# EasyEDA Pro project 电机舵机DCDC驱动板.eprj, schematic Schematic1

## Sheets
1 P1: Board Name: Board1; Create Date: 2025-06-23; Page Name: P1; Project Name: 电机舵机DCDC驱动板; Schematic Name: Schematic1; Update Date: 2025-07-10; Company: 嘉立创EDA; Page Size: A4; Version: V1.0
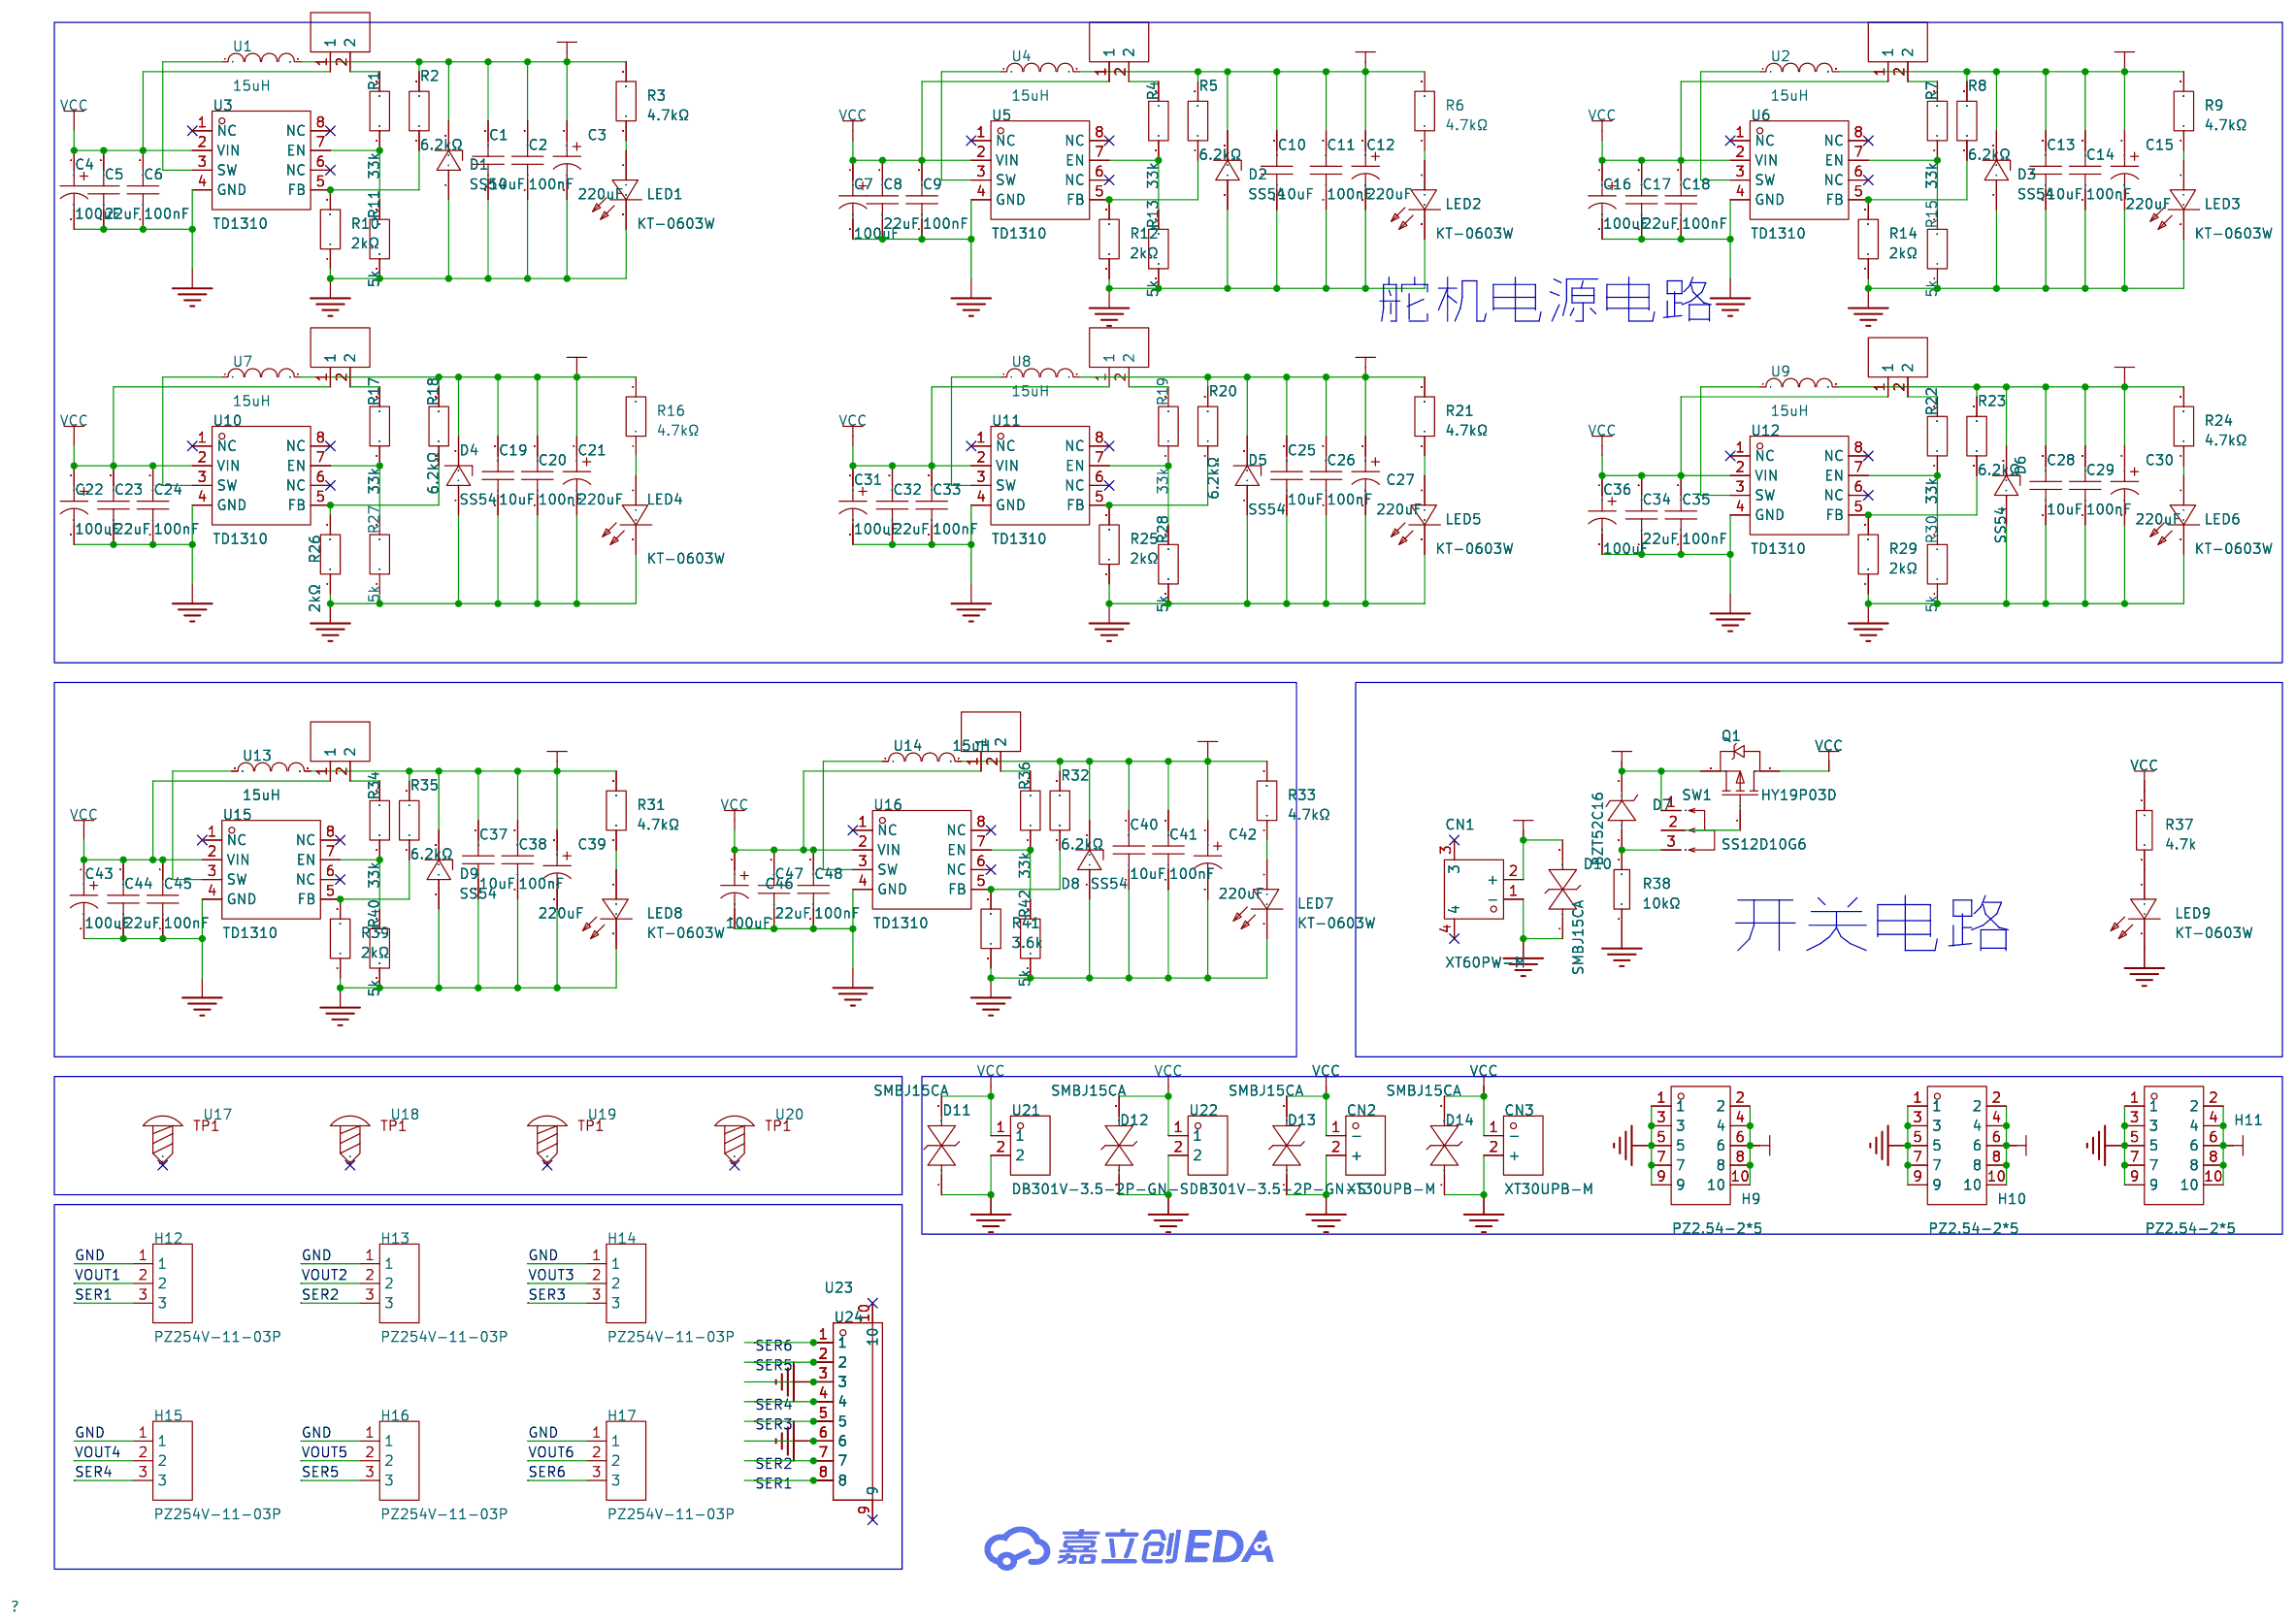
[diagram p0: P1]
2 TPS54821-BUCK: Create Date: 2025-07-09; Page Name: TPS54821-BUCK; Update Date: 2025-07-11; File: TPS54821-BUCK; Id: /; Sheet: /
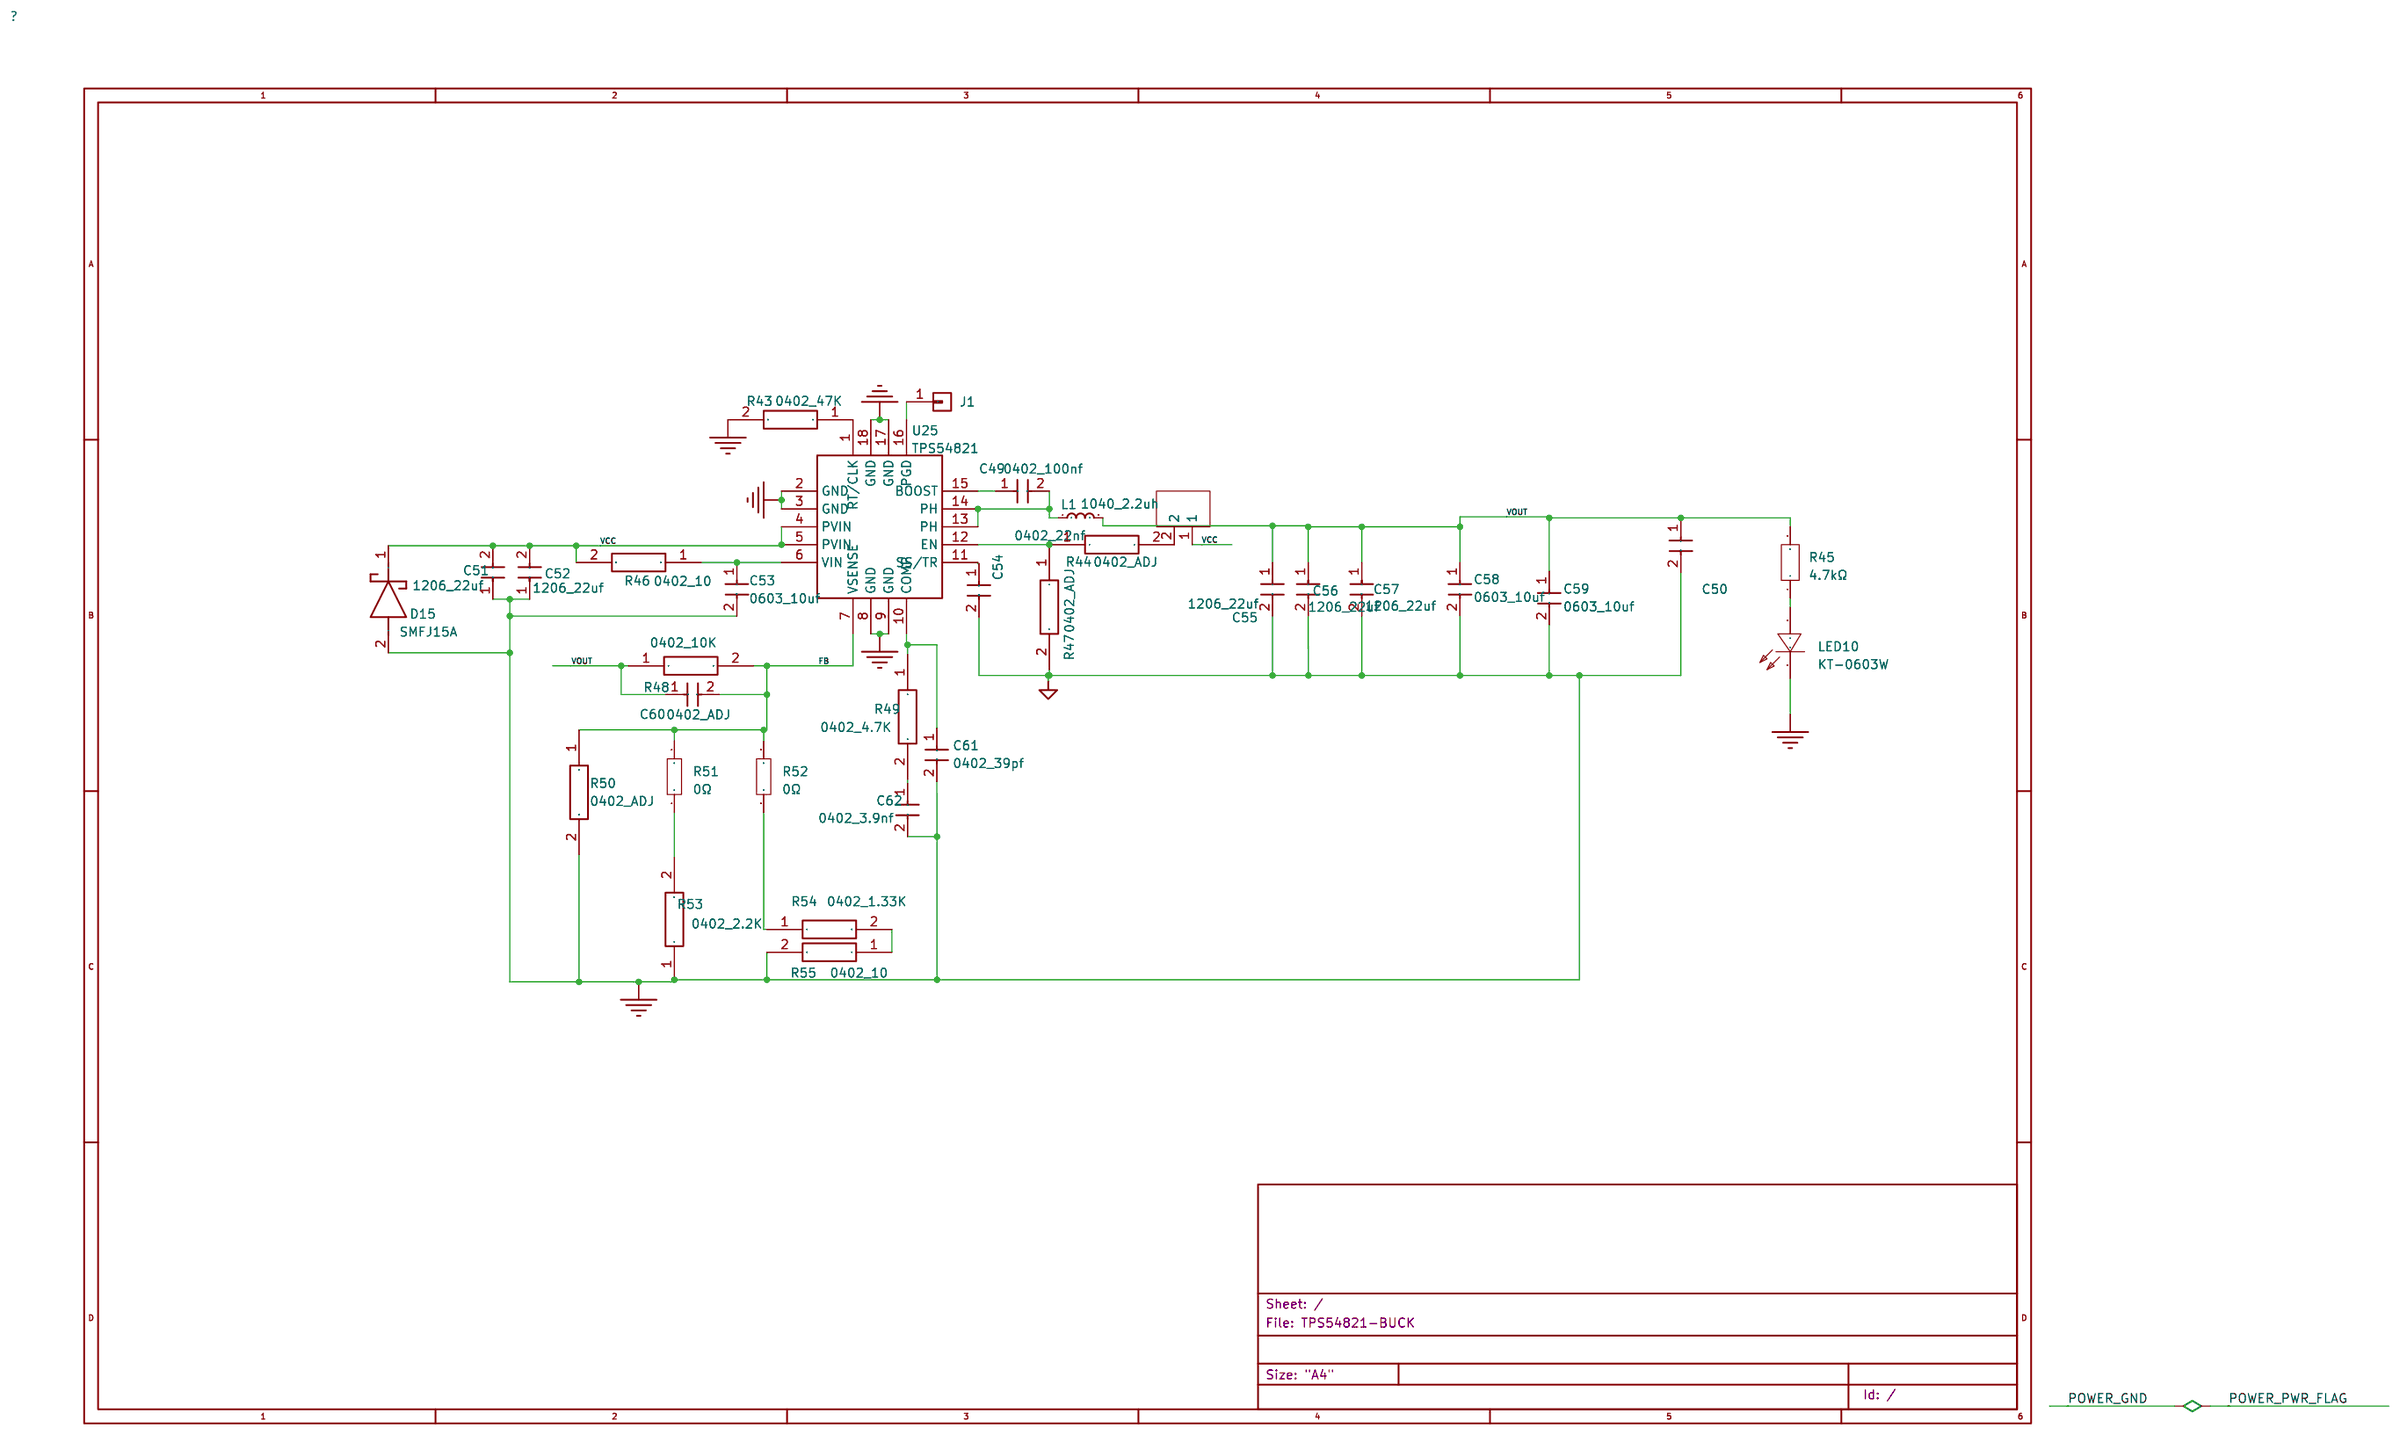
[diagram p1: TPS54821-BUCK]

## Parts
sheet P1
C1  10uF  [C0603]
C2  100nF  [C0402]
C3  220uF  [CAP-SMD_BD6.3-L6.6-W6.6-LS7.8-FD]
C4  100uF  [CAP-SMD_BD6.3-L6.5-W6.5-LS7.0-FD]
C5  22uF  [C0805]
C6  100nF  [C0402]
C7  100uF  [CAP-SMD_BD6.3-L6.5-W6.5-LS7.0-FD]
C8  22uF  [C0805]
C9  100nF  [C0402]
C10  10uF  [C0603]
C11  100nF  [C0402]
C12  220uF  [CAP-SMD_BD6.3-L6.6-W6.6-LS7.8-FD]
C13  10uF  [C0603]
C14  100nF  [C0402]
C15  220uF  [CAP-SMD_BD6.3-L6.6-W6.6-LS7.8-FD]
C16  100uF  [CAP-SMD_BD6.3-L6.5-W6.5-LS7.0-FD]
C17  22uF  [C0805]
C18  100nF  [C0402]
C19  10uF  [C0603]
C20  100nF  [C0402]
C21  220uF  [CAP-SMD_BD6.3-L6.6-W6.6-LS7.8-FD]
C22  100uF  [CAP-SMD_BD6.3-L6.5-W6.5-LS7.0-FD]
C23  22uF  [C0805]
C24  100nF  [C0402]
C25  10uF  [C0603]
C26  100nF  [C0402]
C27  220uF  [CAP-SMD_BD6.3-L6.6-W6.6-LS7.8-FD]
C28  10uF  [C0603]
C29  100nF  [C0402]
C30  220uF  [CAP-SMD_BD6.3-L6.6-W6.6-LS7.8-FD]
C31  100uF  [CAP-SMD_BD6.3-L6.5-W6.5-LS7.0-FD]
C32  22uF  [C0805]
C33  100nF  [C0402]
C34  22uF  [C0805]
C35  100nF  [C0402]
C36  100uF  [CAP-SMD_BD6.3-L6.5-W6.5-LS7.0-FD]
C37  10uF  [C0603]
C38  100nF  [C0402]
C39  220uF  [CAP-SMD_BD6.3-L6.6-W6.6-LS7.8-FD]
C40  10uF  [C0603]
C41  100nF  [C0402]
C42  220uF  [CAP-SMD_BD6.3-L6.6-W6.6-LS7.8-FD]
C43  100uF  [CAP-SMD_BD6.3-L6.5-W6.5-LS7.0-FD]
C44  22uF  [C0805]
C45  100nF  [C0402]
C46  100uF  [CAP-SMD_BD6.3-L6.5-W6.5-LS7.0-FD]
C47  22uF  [C0805]
C48  100nF  [C0402]
CN1  XT60PW-M  [CONN-TH_XT60PW-M]
CN2  XT30UPB-M  [CONN-TH_XT30UPB-M]
CN3  XT30UPB-M  [CONN-TH_XT30UPB-M]
D1  SS54  [SMA_L4.3-W2.6-LS5.0-FD]
D2  SS54  [SMA_L4.3-W2.6-LS5.0-FD]
D3  SS54  [SMA_L4.3-W2.6-LS5.0-FD]
D4  SS54  [SMA_L4.3-W2.6-LS5.0-FD]
D5  SS54  [SMA_L4.3-W2.6-LS5.0-FD]
D6  SS54  [SMA_L4.3-W2.6-LS5.0-FD]
D7  BZT52C16  [SOD-123_L2.7-W1.6-LS3.7-RD]
D8  SS54  [SMA_L4.3-W2.6-LS5.0-FD]
D9  SS54  [SMA_L4.3-W2.6-LS5.0-FD]
D10  SMBJ15CA  [SMB_L4.6-W3.6-LS5.4-BI]
D11  SMBJ15CA  [SMB_L4.6-W3.6-LS5.4-BI]
D12  SMBJ15CA  [SMB_L4.6-W3.6-LS5.4-BI]
D13  SMBJ15CA  [SMB_L4.6-W3.6-LS5.4-BI]
D14  SMBJ15CA  [SMB_L4.6-W3.6-LS5.4-BI]
H1  PZ254V-11-02P  [HDR-TH_2P-P2.54-V-M]
H2  PZ254V-11-02P  [HDR-TH_2P-P2.54-V-M]
H3  PZ254V-11-02P  [HDR-TH_2P-P2.54-V-M]
H4  PZ254V-11-02P  [HDR-TH_2P-P2.54-V-M]
H5  PZ254V-11-02P  [HDR-TH_2P-P2.54-V-M]
H6  PZ254V-11-02P  [HDR-TH_2P-P2.54-V-M]
H7  PZ254V-11-02P  [HDR-TH_2P-P2.54-V-M]
H8  PZ254V-11-02P  [HDR-TH_2P-P2.54-V-M]
H9  PZ2.54-2*5  [HDR-TH_10P-P2.54-V-M-R2-C5-S2.54-1]
H10  PZ2.54-2*5  [HDR-TH_10P-P2.54-V-M-R2-C5-S2.54-1]
H11  PZ2.54-2*5  [HDR-TH_10P-P2.54-V-M-R2-C5-S2.54-1]
H12  PZ254V-11-03P  [HDR-TH_3P-P2.54-V-M]
H13  PZ254V-11-03P  [HDR-TH_3P-P2.54-V-M]
H14  PZ254V-11-03P  [HDR-TH_3P-P2.54-V-M]
H15  PZ254V-11-03P  [HDR-TH_3P-P2.54-V-M]
H16  PZ254V-11-03P  [HDR-TH_3P-P2.54-V-M]
H17  PZ254V-11-03P  [HDR-TH_3P-P2.54-V-M]
LED1  KT-0603W  [LED0603-R-RD_WHITE]
LED2  KT-0603W  [LED0603-R-RD_WHITE]
LED3  KT-0603W  [LED0603-R-RD_WHITE]
LED4  KT-0603W  [LED0603-R-RD_WHITE]
LED5  KT-0603W  [LED0603-R-RD_WHITE]
LED6  KT-0603W  [LED0603-R-RD_WHITE]
LED7  KT-0603W  [LED0603-R-RD_WHITE]
LED8  KT-0603W  [LED0603-R-RD_WHITE]
LED9  KT-0603W  [LED0603-R-RD_WHITE]
Q1  HY19P03D  [TO-252-2_L6.6-W6.1-P4.57-LS9.9-TL-CW]
R1  33k  [R0603]
R2  6.2kΩ  [R0603]
R3  4.7kΩ  [R0603]
R4  33k  [R0603]
R5  6.2kΩ  [R0603]
R6  4.7kΩ  [R0603]
R7  33k  [R0603]
R8  6.2kΩ  [R0603]
R9  4.7kΩ  [R0603]
R10  2kΩ  [R0603]
R11  5k  [R0603]
R12  2kΩ  [R0603]
R13  5k  [R0603]
R14  2kΩ  [R0603]
R15  5k  [R0603]
R16  4.7kΩ  [R0603]
R17  33k  [R0603]
R18  6.2kΩ  [R0603]
R19  33k  [R0603]
R20  6.2kΩ  [R0603]
R21  4.7kΩ  [R0603]
R22  33k  [R0603]
R23  6.2kΩ  [R0603]
R24  4.7kΩ  [R0603]
R25  2kΩ  [R0603]
R26  2kΩ  [R0603]
R27  5k  [R0603]
R28  5k  [R0603]
R29  2kΩ  [R0603]
R30  5k  [R0603]
R31  4.7kΩ  [R0603]
R32  6.2kΩ  [R0603]
R33  4.7kΩ  [R0603]
R34  33k  [R0603]
R35  6.2kΩ  [R0603]
R36  33k  [R0603]
R37  4.7k  [R0603]
R38  10kΩ  [R0603]
R39  2kΩ  [R0603]
R40  5k  [R0603]
R41  3.6k  [R0603]
R42  5k  [R0603]
SW1  SS12D10G6  [SW-TH_SHOU-HAN_SS12D10G4]
U1  15uH  [IND-SMD_L7.2-W6.6_GPSR07X0]
U2  15uH  [IND-SMD_L7.2-W6.6_GPSR07X0]
U3  TD1310  [SOP-8_L4.9-W3.9-P1.27-LS6.0-BL]
U4  15uH  [IND-SMD_L7.2-W6.6_GPSR07X0]
U5  TD1310  [SOP-8_L4.9-W3.9-P1.27-LS6.0-BL]
U6  TD1310  [SOP-8_L4.9-W3.9-P1.27-LS6.0-BL]
U7  15uH  [IND-SMD_L7.2-W6.6_GPSR07X0]
U8  15uH  [IND-SMD_L7.2-W6.6_GPSR07X0]
U9  15uH  [IND-SMD_L7.2-W6.6_GPSR07X0]
U10  TD1310  [SOP-8_L4.9-W3.9-P1.27-LS6.0-BL]
U11  TD1310  [SOP-8_L4.9-W3.9-P1.27-LS6.0-BL]
U12  TD1310  [SOP-8_L4.9-W3.9-P1.27-LS6.0-BL]
U13  15uH  [IND-SMD_L7.2-W6.6_GPSR07X0]
U14  15uH  [IND-SMD_L7.2-W6.6_GPSR07X0]
U15  TD1310  [SOP-8_L4.9-W3.9-P1.27-LS6.0-BL]
U16  TD1310  [SOP-8_L4.9-W3.9-P1.27-LS6.0-BL]
U17  -  [M3]
U18  -  [M3]
U19  -  [M3]
U20  -  [M3]
U21  DB301V-3.5-2P-GN-S  [CONN-TH_DB301V-3.5-2P-GN]
U22  DB301V-3.5-2P-GN-S  [CONN-TH_DB301V-3.5-2P-GN]
U23  SM08B-GHS-TB(LF)(SN)  [CONN-SMD_SM08B-GHS-TB-LF-SN]
U24  BX-XH2.54-8PWZ  [CONN-TH_8P-P2.50_BX-XH2.54-8PWZ]
sheet TPS54821-BUCK
C49  0402_100nf  [JXLBasicFontprint:0402_CAP]
C50  0603_100nf  [JXLBasicFontprint:0603_CAP]
C51  1206_22uf  [JXLBasicFontprint:1206_CAP]
C52  1206_22uf  [JXLBasicFontprint:1206_CAP]
C53  0603_10uf  [JXLBasicFontprint:0603_CAP]
C54  0402_22nf  [JXLBasicFontprint:0402_CAP]
C55  1206_22uf  [JXLBasicFontprint:1206_CAP]
C56  1206_22uf  [JXLBasicFontprint:1206_CAP]
C57  1206_22uf  [JXLBasicFontprint:1206_CAP]
C58  0603_10uf  [JXLBasicFontprint:0603_CAP]
C59  0603_10uf  [JXLBasicFontprint:0603_CAP]
C60  0402_ADJ  [JXLBasicFontprint:0402_CAP]
C61  0402_39pf  [JXLBasicFontprint:0402_CAP]
C62  0402_3.9nf  [JXLBasicFontprint:0402_CAP]
D15  SMFJ15A  [JXLBasicFontprint:Diode_SOD-123F]
H18  PZ254V-11-02P  [HDR-TH_2P-P2.54-V-M]
J1  Conn_01x01  [JXLConnectFontprint:PinHeader_1x01_P2.54mm_Vertical]
L1  1040_2.2uh  [JXLBasicFontprint:1040_L]
LED10  KT-0603W  [LED0603-R-RD_WHITE]
R43  0402_47K  [JXLBasicFontprint:0402_RES]
R44  0402_ADJ  [JXLBasicFontprint:0402_RES]
R45  4.7kΩ  [R0603]
R46  0402_10  [JXLBasicFontprint:0402_RES]
R47  0402_ADJ  [JXLBasicFontprint:0402_RES]
R48  0402_10K  [JXLBasicFontprint:0402_RES]
R49  0402_4.7K  [JXLBasicFontprint:0402_RES]
R50  0402_ADJ  [JXLBasicFontprint:0402_RES]
R51  0Ω  [R0402]
R52  0Ω  [R0402]
R53  0402_2.2K  [JXLBasicFontprint:0402_RES]
R54  0402_1.33K  [JXLBasicFontprint:0402_RES]
R55  0402_10  [JXLBasicFontprint:0402_RES]
U25  TPS54821  [JXLChipFontprint:TPS54620RHLR]

## Library data of the parts
C1 C10 C13 C19 C25 C28 C37 C40 = 10uF_C15415: LCSC Part Name: 10uF ±20% 16V; Supplier Part: C15415; Manufacturer: SAMSUNG(三星); Supplier Footprint: 0603; JLCPCB Part Class: 扩展库; Datasheet: https://atta.szlcsc.com/upload/public/pdf/source/20160218/1457707763339.pdf; Supplier: LCSC; Tolerance: ±20%; Voltage Rated: 16V
C2 C6 C9 C11 C14 C18 C20 C24 C26 C29 C33 C35 C38 C41 C45 C48 = EMF105B7104MVHF: LCSC Part Name: 100nF ±20% 16V; Supplier Part: C2186401; Manufacturer: TAIYO YUDEN(太诱); Supplier Footprint: 0402; JLCPCB Part Class: 扩展库; Datasheet: https://atta.szlcsc.com/upload/public/pdf/source/20240118/62F08BE299C5C20B1124B60DE6B6F7B3.pdf; Supplier: LCSC; Tolerance: ±20%; Voltage Rating: 16V; Temperature Coefficient: X7R
C3 C12 C15 C21 C27 C30 C39 C42 = GVT1E227M0608CNVC: 容值:220uF;精度:±20%;额定电压:25V;纹波电流:120mA@120Hz;; LCSC Part Name: 220uF ±20% 25V; Supplier Part: C2983317; Manufacturer: HRK(鸿瑞凯电子); Supplier Footprint: SMD,D6.3xL7.7mm; JLCPCB Part Class: 扩展库; Datasheet: https://atta.szlcsc.com/upload/public/pdf/source/20220321/A04A91A46495B899B204BF58325E1842.pdf; Supplier: LCSC; Tolerance: ±20%; Rated Voltage: 25V; Ripple Current: 120mA@120Hz; φD: 6.3mm; L: 8mm; Lifetime @ Temp: 2000hrs@105℃; Operating Temperature: -55℃~+105℃
C4 C7 C16 C22 C31 C36 C43 C46 = JBLM2101M035C077RTM 100UF 35V: 容值:100uF;精度:±20%;额定电压:35V;纹波电流:1.87A@100kHz;等效串联电阻(ESR):80mΩ@100kHz;; LCSC Part Name: 100uF ±20% 35V; Supplier Part: C19270709; Manufacturer: DMBJ(振宝佳); Supplier Footprint: SMD,D6.3xL7.7mm; Datasheet: https://atta.szlcsc.com/upload/public/pdf/source/20240116/CA29FFB53BFA8073E6BC602EF1F168F9.pdf; Supplier: LCSC; Tolerance: ±20%; Voltage Rating: 35V; Ripple Current: 1.87A@100kHz; Equivalent Series Resistance(ESR): 80mΩ@100kHz; Lifetime: 2000hrs@105℃
C5 C8 C17 C23 C32 C34 C44 C47 = CL21X226MPYNNWE: LCSC Part Name: 22uF ±20% 10V; Supplier Part: C3039697; Manufacturer: SAMSUNG(三星); Supplier Footprint: 0805; JLCPCB Part Class: 扩展库; Datasheet: https://atta.szlcsc.com/upload/public/pdf/source/20220622/C94FE7D0962FB97783949781CDB41BA5.pdf; Supplier: LCSC; Tolerance: ±20%; Voltage Rating: 10V; Temperature Coefficient: X6S
CN1 = XT60PW-M: LCSC Part Name: AMASS(艾迈斯)航模插头xt60连接器150公母对接pw锂电池公头 板插卧式XT60PW-M; Supplier Part: C98732; Manufacturer: AMASS(艾迈斯); JLCPCB Part Class: 扩展库; Datasheet: https://atta.szlcsc.com/upload/public/pdf/source/20240118/44A3DCFF53BE25DC65378AFFB21277A4.pdf; Supplier: LCSC; Type: 卧式插头; Colour: 黄色; InterfaceType: 公头
CN2 CN3 = XT30UPB-M: LCSC Part Name: AMASS(艾迈斯)板载立式 航模锂电池控制器连接器插头 公头XT30UPB-M; Supplier Part: C428721; Manufacturer: AMASS(艾迈斯); JLCPCB Part Class: 扩展库; Datasheet: https://atta.szlcsc.com/upload/public/pdf/source/20230412/7B5DFEF57C9EA5273853390C734B3AC5.pdf; Supplier: LCSC; Type: 航模插头; Colour: 黄色; RatedVoltage: DC 500V; InterfaceType: 公头; MetalMaterial: 镀金; InsulationMaterial: PA; RatedCurrent: 15A; contact resistance: 0.65mΩ
D1-D6 D8 D9 = SS54_C7420369: 二极管配置:独立式;正向压降(Vf):550mV@5.0A;直流反向耐压(Vr):40V;整流电流:5A;; LCSC Part Name: 电压:40V 电流:5A; Supplier Part: C7420369; Manufacturer: 宏迦橙; Supplier Footprint: SMA(DO-214AC); JLCPCB Part Class: 扩展库; Datasheet: https://atta.szlcsc.com/upload/public/pdf/source/20230828/254C3882F8647358AD9F60DD73611B5E.pdf; Supplier: LCSC; Diode Configuration: 独立式; Forward Voltage (Vf@If): 550mV@5.0A; Reverse Voltage (Vr): 40V; Rectified Current: 5A; Reverse Leakage Current (Ir): 50uA@40V
D7 = BZT52C16_C19077413: 二极管配置:独立式;稳压值(标称值):16V;稳压值(范围):15.2V~16.8V;耗散功率(Pd):500mW;; Supplier Part: C19077413; Manufacturer: 宏嘉诚; Supplier Footprint: SOD-123; JLCPCB Part Class: 扩展库; Datasheet: https://atta.szlcsc.com/upload/public/pdf/source/20250106/E12AA82D484C9C66E469D005F460C1F7.pdf; Supplier: LCSC; Diode Configuration: 独立式; Zener Voltage(Nom): 16V; Reverse Leakage Current (Ir): 100nA@11.2V; Zener Voltage(Range): 15.2V~16.8V; Pd - Power Dissipation(Pd): 500mW; Impedance(Zzt): 45Ω
D10-D14 = SMBJ15CA_C19077570: 极性:双向;反向截止电压(Vrwm):15V;钳位电压:24.4V;峰值脉冲电流(Ipp):24.59A;峰值脉冲功率(Ppp):600W;击穿电压:18.5V;; Supplier Part: C19077570; Manufacturer: 宏嘉诚; Supplier Footprint: SMB; JLCPCB Part Class: 扩展库; Datasheet: https://atta.szlcsc.com/upload/public/pdf/source/20250107/474F05451FC8AB27D7FA0238914F96F6.pdf; Supplier: LCSC; Polarity: 双向; Reverse Stand-Off Voltage (Vrwm): 15V; Clamping Voltage: 24.4V; Peak Pulse Current (Ipp): 24.59A; Peak Pulse Power Dissipation (Ppp): 600W; Voltage - Breakdown: 18.5V; Reverse Leakage Current (Ir): 5uA; Type: TVS
H1-H8 H18 = PZ254V-11-02P: LCSC Part Name: 1x2P 间距:2.54mm 方针 直插; Supplier Part: C492401; Manufacturer: XFCN(兴飞); Supplier Footprint: 插件,P=2.54mm; JLCPCB Part Class: 扩展库; Datasheet: https://atta.szlcsc.com/upload/public/pdf/source/20200309/C492401_A812433581A9B211A7FFA413ADDFF0E5.pdf; Supplier: LCSC; Pin Structure: 1x2P; Pitch: 2.54mm; Circluar Pins/Square Pins: 方针; Mounting Type: 直插; Number of Rows: 单排; Number of Pins: 2P; Length of Mating Pin: 6mm; Insulation Height: 2.5mm; Length of End Connection Pin: 3mm; Contact Material: 黄铜; Operating Temperature: -40℃~+105℃; Color: 黑色
H9-H11 = PZ2.54-2*5: Supplier Part: C5156677; Manufacturer: ZHOURI(洲日); Supplier Footprint: 插件,P=2.54mm; JLCPCB Part Class: 扩展库; Datasheet: https://atta.szlcsc.com/upload/public/pdf/source/20220923/FF9D303E4B04AC19FF78D5B876650950.pdf; Supplier: LCSC; Pin Structure: 2x5P; Pitch: 2.54mm; Number of Rows: 双排; Number of Pins: 10P
H12-H17 = PZ254V-11-03P: 插针结构:1x3P;间距:2.54mm;行距:-;圆针/方针:方针;安装方式:直插;排数:单排;总PIN位数:3P;额定电流:3A;额定电压:250V;配合针长度:6mm;塑高:2.5mm;端接针长度:3mm;工作温度:-40℃~+105℃;颜色:黑色;; LCSC Part Name: 1x3P 间距:2.54mm 方针 直插; Supplier Part: C2937625; Manufacturer: XFCN(兴飞); Supplier Footprint: 插件,P=2.54mm; JLCPCB Part Class: 扩展库; Datasheet: https://atta.szlcsc.com/upload/public/pdf/source/20200309/C492402_8335C3D49C4E4C618838D59BB1D024C1.pdf; Supplier: LCSC; Pin Structure: 1x3P; Pitch: 2.54mm; Circluar Pins/Square Pins: 方针; Mounting Type: 直插; Number of Rows: 单排; Number of Pins: 3P; Current Rating: 3A; Voltage Rating (Max): 250V; Length of Mating Pin: 6mm; Insulation Height: 2.5mm; Length of End Connection Pin: 3mm; Operating Temperature: -40℃~+105℃; Color: 黑色
LED1-LED10 = KT-0603W: LCSC Part Name: 0603 白灯 高亮; Supplier Part: C2290; Manufacturer: KENTO; Supplier Footprint: 0603; JLCPCB Part Class: 基础库; Datasheet: https://atta.szlcsc.com/upload/public/pdf/source/20221101/4C23D5C85BA051E44A00B833D0A41468.pdf; Supplier: LCSC; Emitted Color: 白色
Q1 = HY19P03D: 类型:P沟道;漏源电压(Vdss):30V;连续漏极电流(Id):90A;功率(Pd):50W;导通电阻(RDS(on)@Vgs,Id):6mΩ@10V,45A;阈值电压(Vgs(th)@Id):3V@250uA;; LCSC Part Name: P沟道 耐压:30V 电流:90A; Supplier Part: C122492; Manufacturer: HUAYI(华羿微); Supplier Footprint: TO-252-2; JLCPCB Part Class: 扩展库; Datasheet: https://atta.szlcsc.com/upload/public/pdf/source/20170728/C122492_1501225751911848809.pdf; Supplier: LCSC; Type: P沟道; Drain Source Voltage (Vdss): 30V; Continuous Drain Current (Id): 90A; Power Dissipation (Pd): 50W; Drain Source On Resistance (RDS(on)@Vgs,Id): 6mΩ@10V,45A; Gate Threshold Voltage (Vgs(th)@Id): 3V@250uA
R1 R2 R4 R5 R7 R8 R11 R13 R15 R17-R20 R22 R23 R27 R28 R30 R32 R34-R36 R40 R42 = FRC0603F6201TS: 电阻类型:厚膜电阻;阻值:6.2kΩ;精度:±1%;功率:100mW;工作电压:75V;温度系数:±100ppm/℃;; LCSC Part Name: 6.2kΩ ±1% 100mW 厚膜电阻; Supplier Part: C2907054; Manufacturer: FOJAN(富捷); Supplier Footprint: 0603; JLCPCB Part Class: 扩展库; Datasheet: https://atta.szlcsc.com/upload/public/pdf/source/20211221/925EC7D7225764EE0046F22065062C87.pdf; Supplier: LCSC; Type: 厚膜电阻; Tolerance: ±1%; Power(Watts): 100mW; Voltage-Supply(Max): 75V; Temperature Coefficient: ±100ppm/℃; Operating Temperature: -55℃~+155℃
R3 R6 R9 R16 R21 R24 R31 R33 R45 = RMF06JT472: LCSC Part Name: 0603 5%(T) 4.7KΩ; Supplier Part: C7463354; Manufacturer: 大毅科技; Supplier Footprint: 0603; Datasheet: https://atta.szlcsc.com/upload/public/pdf/source/20230714/9672FBC6A486AB4BB13741570FD7135B.pdf; Supplier: LCSC; Tolerance: ±5%; Power(Watts): 100mW
R10 R12 R14 R25 R26 R29 R39 R41 = SG73G1JTTD2001D: 阻值:2kΩ;精度:±0.5%;; LCSC Part Name: 2kΩ ±0.5%; Supplier Part: C7311017; Manufacturer: KOA; Supplier Footprint: 0603; JLCPCB Part Class: 扩展库; Datasheet: https://atta.szlcsc.com/upload/public/pdf/source/231023/SG73G-8eb698194ee0c988b5b97f1f282cce7d.pdf; Supplier: LCSC; Tolerance: ±0.5%
R37 R38 = TR0603B10K0P0525Z: 电阻类型:薄膜电阻;阻值:10kΩ;精度:±0.1%;功率:100mW;最大工作电压:75V;温度系数:±25ppm/℃;; LCSC Part Name: 薄膜电阻 10kΩ ±0.1% 100mW; Supplier Part: C188363; Manufacturer: EVER OHMS(天二科技); Supplier Footprint: 0603; JLCPCB Part Class: 扩展库; Datasheet: https://atta.szlcsc.com/upload/public/pdf/source/20190527/C149900_32B1354086E9F6A772108AB7B2B7A514.pdf; Supplier: LCSC; Type: 薄膜电阻; Tolerance: ±0.1%; Power(Watts): 100mW; Overload Voltage (Max): 75V; Temperature Coefficient: ±25ppm/℃; Operating Temperature Range: -55℃~+155℃
SW1 = SS12D10G6: 电路结构:单刀双掷;安装方式:直插;额定电流:2A;额定电压:125V;工作寿命:3千次;; LCSC Part Name: 两档立式插件 3脚拨动开关 柄长6.0mm; Supplier Part: C7431055; Manufacturer: SHOU HAN(首韩); Supplier Footprint: 插件; Datasheet: https://atta.szlcsc.com/upload/public/pdf/source/20231130/59B46964A334F2EAD7849AEEA09A75AE.pdf; Supplier: LCSC; Circuit: 单刀双掷; Length: 12.7mm; Width: 6.7mm; Mounting Type: 直插; Current Rating: 2A; Voltage Rating: 125V; Life: 3千次; Operating Temperature: -25℃~+70℃
U1 U2 U4 U7-U9 U13 U14 = CYA0630-15UH: 电感值:15uH;精度:±20%;额定电流:3A;直流电阻(DCR):98mΩ;; LCSC Part Name: 15uH ±20%; Supplier Part: C5189959; Manufacturer: SHOU HAN(首韩); Supplier Footprint: SMD,7.2x6.6mm; JLCPCB Part Class: 扩展库; Datasheet: https://atta.szlcsc.com/upload/public/pdf/source/20230523/5F86F4489D0E29735640AB8FD07036BA.pdf; Supplier: LCSC; Tolerance: ±20%; Rated Current: 3A; DC Resistance (DCR): 98mΩ
U3 U5 U6 U10-U12 U15 U16 = TD1310: 功能类型:降压型;; LCSC Part Name: 3.5A 380KHz 28V PWM Buck DC/DC 转换器; Supplier Part: C431044; Manufacturer: Techcode(泰德); Supplier Footprint: SOP-8; JLCPCB Part Class: 扩展库; Datasheet: https://atta.szlcsc.com/upload/public/pdf/source/20190923/C431044_12322D488571C047397B95BB4609255E.pdf; Supplier: LCSC; Function: 降压型
U17-U20 = M3
U21 U22 = DB301V-3.5-2P-GN-S: LCSC Part Name: 1x2P 3.5mm 直插 排数:1 每排P数:2; Supplier Part: C695629; Manufacturer: DORABO(地博电气); Supplier Footprint: 插件,P=3.5mm; JLCPCB Part Class: 扩展库; Datasheet: https://atta.szlcsc.com/upload/public/pdf/source/20230106/1B95616A85A883CA085E21635C8A8490.pdf; Supplier: LCSC; Number of Positions or Pins: 1x2P; Pitch: 3.5mm; Color: 绿色; Mounting Type: 直插; Number of Pins: 2P; Number of Rows: 1; Number of PINs Per Row: 2; Screw Specification: M2; Current Rating: 7A; Voltage Rating (Max): 300V; Operating Temperature: -40℃~+105℃
U23 = SM08B-GHS-TB(LF)(SN): LCSC Part Name: 1x8P 间距:1.25mm 卧贴 系列:GH; Supplier Part: C265111; Manufacturer: JST; Supplier Footprint: SMD,P=1.25mm,卧贴; JLCPCB Part Class: 扩展库; Datasheet: https://atta.szlcsc.com/upload/public/pdf/source/20221128/D5F81EE9B4EA03745FB033843433A0AF.pdf; Supplier: LCSC; Pins Structure: 1x8P; Pitch: 1.25mm; Mounting Style: 卧贴; Reference Series: GH; Number of Pins: 8P; Number of Rows: 1; Number of PINs Per Row: 8; Current Rating (Max): 1A; Contact Material: 磷青铜; Contact Plating: 锡; Operating Temperature Range: -25℃~+85℃; Rated Voltage (Max): 50V; Plastic Material: PA9T; Flame Retardant Rating: UL94V-0; Supplementary Features: 辅助焊脚; Colour: 白色; Z-Height of the Board: 4.25mm; X-Length of Bottom Edge on Board (Spacing Line): 13.25mm; Y-Width of Bottom Edge on Board: 4.13mm
U24 = BX-XH2.54-8PWZ: LCSC Part Name: 1x8P 间距:2.5mm 弯插 系列:XH; Supplier Part: C18077848; Manufacturer: Bossie(博锡); Supplier Footprint: 弯插,P=2.54mm; JLCPCB Part Class: 扩展库; Datasheet: https://atta.szlcsc.com/upload/public/pdf/source/20231017/41AC97E47A986FC17CA1415D1E63C8BA.pdf; Supplier: LCSC; Pins Structure: 1x8P; Pitch: 2.5mm; Mounting Type: 弯插; Reference Series: XH; Number of Pins: 8P; Number of Rows: 1; Number of PINs Per Row: 8; Current Rating: 3A; Contact Material: 黄铜; Contact Plating: 锡; Operating Temperature: -25℃~+85℃; Voltage Rating: 250V; Plastic Material: PA66; Flame Retardant Rating: UL94V-0; Color: 白色; Z-Height of the Board: 5.9mm; X-Length of Bottom Edge on Board (Spacing Line): 22.5mm; Y-Width of Bottom Edge on Board: 7.32mm
C49 C54 C60-C62 = JXLBasic_0402_CAP: height: 0.55; User doc link: https://atta.szlcsc.com/upload/public/pdf/source/20220823/2B02EE04F8F211D38A52DCB16EB6BEBA.pdf; Height: 0.55
C50 C53 C58 C59 = JXLBasic_0603_CAP: height: 0.55; User doc link: https://atta.szlcsc.com/upload/public/pdf/source/20220823/2B02EE04F8F211D38A52DCB16EB6BEBA.pdf; Height: 0.55
C51 C52 C55-C57 = JXLBasic_1206_CAP: height: 0.55; User doc link: https://atta.szlcsc.com/upload/public/pdf/source/20220823/2B02EE04F8F211D38A52DCB16EB6BEBA.pdf; Height: 0.55
D15 = JXLBasic_Diode_SOD-123F: User doc link: https://atta.szlcsc.com/upload/public/pdf/source/20190305/C41029_7EEC8BE9111EDCB4600664A05F84C156.pdf
J1 = JXLConnect_Conn_01x01
L1 = JXLBasic_1040_L
R43 R44 R46-R50 R53-R55 = JXLBasic_0402_RES: height: 0.4; User doc link: https://atta.szlcsc.com/upload/public/pdf/source/20171221/C106225_15138309973201195185.pdf; Height: 0.4
R51 R52 = 0402WGF0000TCE: LCSC Part Name: 0Ω ±1% 62.5mW 厚膜电阻; Supplier Part: C17168; Manufacturer: UNI-ROYAL(厚声); Supplier Footprint: 0402; JLCPCB Part Class: 基础库; Datasheet: https://atta.szlcsc.com/upload/public/pdf/source/20200306/C422600_1E6D84923E4A46A82E41ADD87F860B5C.pdf; Supplier: LCSC; Type: 厚膜电阻; Tolerance: ±1%; Power(Watts): 62.5mW; Overload Voltage (Max): 50V; Temperature Coefficient: ±800ppm/℃; Operating Temperature Range: -55℃~+155℃
U25 = JXLChip_TPS54821: User doc link: https://www.ti.com.cn/cn/lit/ds/symlink/tps54620.pdf?ts=1698285172974&ref_url=https%253A%252F%252Fwww.ti.com.cn%252Fsitesearch%252Fzh-cn%252Fdocs%252Funiversalsearch.tsp%253FlangPref%253Dzh-CN%2526searchTerm%253DTPS54620RGY%2526nr%253D45

## Nets
GND: C1.1 C2.1 C3.2 C4.2 C5.1 C6.1 C7.2 C8.1 C9.1 C10.1 C11.1 C12.2 C13.1 C14.1 C15.2 C16.2 C17.1 C18.1 C19.1 C20.1 C21.2 C22.2 C23.1 C24.1 C25.1 C26.1 C27.2 C28.1 C29.1 C30.2 C31.2 C32.1 C33.1 C34.1 C35.1 C36.2 C37.1 C38.1 C39.2 C40.1 C41.1 C42.2 C43.2 C44.1 C45.1 C46.2 C47.1 C48.1 C50.2 C51.1 C52.1 C53.2 C54.2 C55.2 C57.2 C58.2 C59.2 C61.2 C62.2 CN1.1(-) CN2.2(+) CN3.2(+) D1.1(A) D2.1(A) D3.1(A) D4.1(A) D5.1(A) D6.1(A) D8.1(A) D9.1(A) D10.1 D11.1 D12.1 D13.1 D14.1 D15.2(A) H9.1 H9.3 H9.5 H9.7 H9.9 H10.1 H10.3 H10.5 H10.7 H10.9 H11.1 H11.3 H11.5 H11.7 H11.9 H12.1 H13.1 H14.1 H15.1 H16.1 H17.1 LED1.2(K) LED2.2(K) LED3.2(K) LED4.2(K) LED5.2(K) LED6.2(K) LED7.2(K) LED8.2(K) LED9.2(K) LED10.2(K) R10.1 R11.1 R12.1 R13.1 R14.1 R15.1 R25.1 R26.1 R27.1 R28.1 R29.1 R30.1 R38.1 R39.1 R40.1 R41.1 R42.1 R43.2 R47.2 R50.2 R53.1 R55.2 U3.4(GND) U5.4(GND) U6.4(GND) U10.4(GND) U11.4(GND) U12.4(GND) U15.4(GND) U16.4(GND) U21.2 U22.2 U23.3 U23.6 U24.3 U24.6 U25.2(GND) U25.3(GND) U25.8(GND) U25.9(GND) U25.17(GND) U25.18(GND)
VCC: C4.1 C5.2 C6.2 C7.1 C8.2 C9.2 C16.1 C17.2 C18.2 C22.1 C23.2 C24.2 C31.1 C32.2 C33.2 C34.2 C35.2 C36.1 C43.1 C44.2 C45.2 C46.1 C47.2 C48.2 C51.2 C52.2 CN2.1(-) CN3.1(-) D11.2 D12.2 D13.2 D14.2 D15.1(K) H1.1 H2.1 H3.1 H4.1 H5.1 H6.1 H7.1 H8.1 H18.1 Q1.2(D) R37.2 R46.2 U3.2(VIN) U5.2(VIN) U6.2(VIN) U10.2(VIN) U11.2(VIN) U12.2(VIN) U15.2(VIN) U16.2(VIN) U21.1 U22.1 U25.4(PVIN) U25.5(PVIN)
VCCIN: CN1.2(+) D7.1(K) D10.2 Q1.3(S) SW1.1
FB: C60.2 R48.2 R50.1 R51.2 R52.2 U25.7(VSENSE)
SER1: H12.3 U23.8 U24.8
SER2: H13.3 U23.7 U24.7
SER3: H14.3 U23.5 U24.5
SER4: H15.3 U23.4 U24.4
SER5: H16.3 U23.2 U24.2
SER6: H17.3 U23.1 U24.1
VOUT: C50.1 C55.1 C56.1 C57.1 C58.1 C59.1 C60.1 H11.2 H11.4 H11.6 H11.8 H11.10 R45.2 R48.1
VOUT1: C1.2 C2.2 C3.1 D1.2(K) H12.2 R2.2 R3.2 U1.2
VOUT1-3.3: C40.2 C41.2 C42.1 D8.2(K) H10.2 H10.4 H10.6 H10.8 H10.10 R32.2 R33.2 U14.2
VOUT1-5: C37.2 C38.2 C39.1 D9.2(K) H9.2 H9.4 H9.6 H9.8 H9.10 R31.2 R35.2 U13.2
VOUT2: C10.2 C11.2 C12.1 D2.2(K) H13.2 R5.2 R6.2 U4.2
VOUT3: C13.2 C14.2 C15.1 D3.2(K) H14.2 R8.2 R9.2 U2.2
VOUT4: C19.2 C20.2 C21.1 D4.2(K) H15.2 R16.2 R18.2 U7.2
VOUT5: C25.2 C26.2 C27.1 D5.2(K) H16.2 R20.2 R21.2 U8.2
VOUT6: C28.2 C29.2 C30.1 D6.2(K) H17.2 R23.2 R24.2 U9.2
$1N956: R2.1 R10.2 U3.5(FB)
$1N1041: U1.1 U3.3(SW)
$1N2956: R5.1 R12.2 U5.5(FB)
$1N2957: U4.1 U5.3(SW)
$1N3279: R8.1 R14.2 U6.5(FB)
$1N3280: U2.1 U6.3(SW)
$1N3602: R18.1 R26.2 U10.5(FB)
$1N3603: U7.1 U10.3(SW)
$1N3925: R23.1 R29.2 U12.5(FB)
$1N3926: U9.1 U12.3(SW)
$1N4248: R20.1 R25.2 U11.5(FB)
$1N4249: U8.1 U11.3(SW)
$1N11484: R35.1 R39.2 U15.5(FB)
$1N11485: U13.1 U15.3(SW)
$1N11808: R32.1 R41.2 U16.5(FB)
$1N11809: U14.1 U16.3(SW)
$1N35762: R17.1 R27.2 U10.7(EN)
$1N35925: R1.1 R11.2 U3.7(EN)
$1N35986: R4.1 R13.2 U5.7(EN)
$1N36186: R7.1 R15.2 U6.7(EN)
$1N36312: R22.1 R30.2 U12.7(EN)
$1N36350: R19.1 R28.2 U11.7(EN)
$1N36658: R34.1 R40.2 U15.7(EN)
$1N36809: R36.1 R42.2 U16.7(EN)
$1N37466: H7.2 R34.2
$1N37572: H4.2 R17.2
$1N37631: H1.2 R1.2
$1N37690: H2.2 R4.2
$1N37749: H3.2 R7.2
$1N37808: H6.2 R22.2
$1N37867: H8.2 R36.2
$1N37927: H5.2 R19.2
$1N42054: LED8.1(A) R31.1
$1N42156: LED7.1(A) R33.1
$1N42254: LED4.1(A) R16.1
$1N43125: Q1.1(G) SW1.2
$1N43127: D7.2(A) R38.2 SW1.3
$1N43793: LED1.1(A) R3.1
$1N43891: LED2.1(A) R6.1
$1N43990: LED3.1(A) R9.1
$1N44088: LED6.1(A) R24.1
$1N44287: LED5.1(A) R21.1
$1N44383: LED9.1(A) R37.1
$2N2: R54.2 R55.1
$2N4: C53.1 R46.1 U25.6(VIN)
$2N17: C61.1 R49.1 U25.10(COMP)
$2N22: C62.1 R49.2
$2N33: R44.1 R47.1 U25.12(EN)
$2N37: J1.1(Pin) U25.16(PGD)
$2N39: C49.1 U25.15(BOOST)
$2N41: R52.1 R54.1
$2N43: R51.1 R53.2
$2N500: C54.1 U25.11(SS/TR)
$2N3054: R43.1 U25.1(RT/CLK)
$2N4928: H18.2 R44.2
$2N6158: LED10.1(A) R45.1
Net-(C49-2): C49.2 U25.13(PH) U25.14(PH)

Not connected (* = marked no-connect by the designer): C56 2; CN1 3* 4*; L1 1 2; U3 1(NC)* 6(NC)* 8(NC)*; U5 1(NC)* 6(NC)* 8(NC)*; U6 1(NC)* 6(NC)* 8(NC)*; U10 1(NC)* 6(NC)* 8(NC)*; U11 1(NC)* 6(NC)* 8(NC)*; U12 1(NC)* 6(NC)* 8(NC)*; U15 1(NC)* 6(NC)* 8(NC)*; U16 1(NC)* 6(NC)* 8(NC)*; U17 1*; U18 1*; U19 1*; U20 1*; U23 9* 10*

## Notes on the sheets
sheet 1
- 舵机电源电路
- 开关电路
